# Altium project Liv_Flo_Sign.PrjPcb (part 2 of 2)
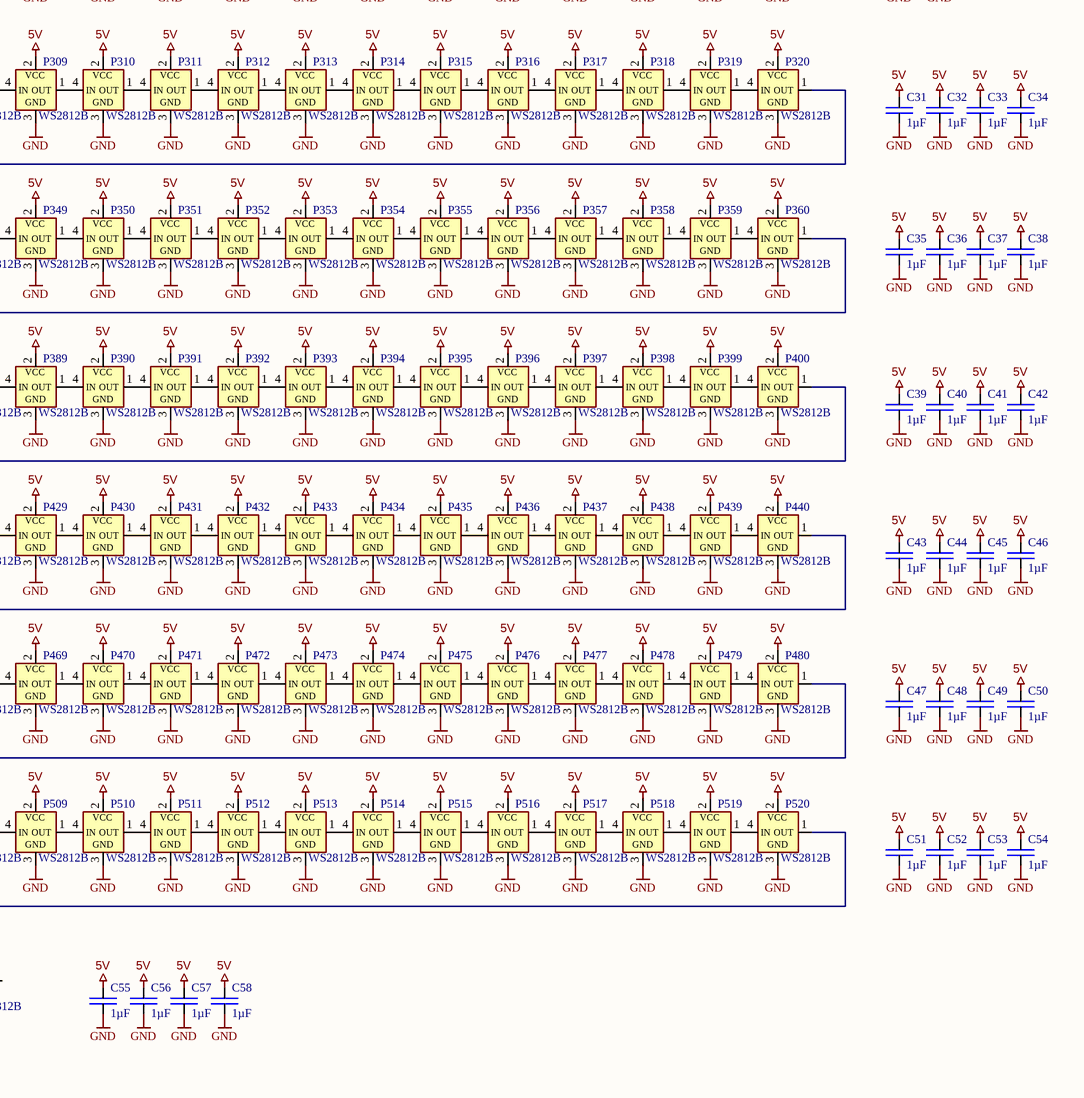
[diagram p5: Liv_Flo_Sign_LED_V1.0.SchDoc, bottom right]

## Sheet Liv_Flo_Sign_LED_V1.0.SchDoc: Liv-Flo Sign (continued)

### Nets
5V: C17.2 C18.2 C19.2 C20.2 C21.2 C22.2 C23.2 C24.2 C25.2 C26.2 C27.2 C28.2 C29.2 C30.2 C31.2 C32.2 C33.2 C34.2 C35.2 C36.2 C37.2 C38.2 C39.2 C40.2 C41.2 C42.2 C43.2 C44.2 C45.2 C46.2 C47.2 C48.2 C49.2 C50.2 C51.2 C52.2 C53.2 C54.2 C55.2 C56.2 C57.2 C58.2 P1.2(VCC) P2.2(VCC) P3.2(VCC) P4.2(VCC) P5.2(VCC) P6.2(VCC) P7.2(VCC) P8.2(VCC) P9.2(VCC) P10.2(VCC) P11.2(VCC) P12.2(VCC) P13.2(VCC) P14.2(VCC) P15.2(VCC) P16.2(VCC) P17.2(VCC) P18.2(VCC) P19.2(VCC) P20.2(VCC) P21.2(VCC) P22.2(VCC) P23.2(VCC) P24.2(VCC) P25.2(VCC) P26.2(VCC) P27.2(VCC) P28.2(VCC) P29.2(VCC) P30.2(VCC) P31.2(VCC) P32.2(VCC) P33.2(VCC) P34.2(VCC) P35.2(VCC) P36.2(VCC) P37.2(VCC) P38.2(VCC) P39.2(VCC) P40.2(VCC) P41.2(VCC) P42.2(VCC) P43.2(VCC) P44.2(VCC) P45.2(VCC) P46.2(VCC) P47.2(VCC) P48.2(VCC) P49.2(VCC) P50.2(VCC) P51.2(VCC) P52.2(VCC) P53.2(VCC) P54.2(VCC) P55.2(VCC) P56.2(VCC) P57.2(VCC) P58.2(VCC) P59.2(VCC) P60.2(VCC) P61.2(VCC) P62.2(VCC) P63.2(VCC) P64.2(VCC) P65.2(VCC) P66.2(VCC) P67.2(VCC) P68.2(VCC) P69.2(VCC) P70.2(VCC) P71.2(VCC) P72.2(VCC) P73.2(VCC) P74.2(VCC) P75.2(VCC) P76.2(VCC) P77.2(VCC) P78.2(VCC) P79.2(VCC) P80.2(VCC) P81.2(VCC) P82.2(VCC) P83.2(VCC) P84.2(VCC) P85.2(VCC) P86.2(VCC) P87.2(VCC) P88.2(VCC) P89.2(VCC) P90.2(VCC) P91.2(VCC) P92.2(VCC) P93.2(VCC) P94.2(VCC) P95.2(VCC) P96.2(VCC) P97.2(VCC) P98.2(VCC) P99.2(VCC) P100.2(VCC) P101.2(VCC) P102.2(VCC) P103.2(VCC) P104.2(VCC) P105.2(VCC) P106.2(VCC) P107.2(VCC) P108.2(VCC) P109.2(VCC) P110.2(VCC) P111.2(VCC) P112.2(VCC) P113.2(VCC) P114.2(VCC) P115.2(VCC) P116.2(VCC) P117.2(VCC) P118.2(VCC) P119.2(VCC) P120.2(VCC) P121.2(VCC) P122.2(VCC) P123.2(VCC) P124.2(VCC) P125.2(VCC) P126.2(VCC) P127.2(VCC) P128.2(VCC) P129.2(VCC) P130.2(VCC) P131.2(VCC) P132.2(VCC) P133.2(VCC) P134.2(VCC) P135.2(VCC) P136.2(VCC) P137.2(VCC) P138.2(VCC) P139.2(VCC) P140.2(VCC) P141.2(VCC) P142.2(VCC) P143.2(VCC) P144.2(VCC) P145.2(VCC) P146.2(VCC) P147.2(VCC) P148.2(VCC) P149.2(VCC) P150.2(VCC) P151.2(VCC) P152.2(VCC) P153.2(VCC) P154.2(VCC) P155.2(VCC) P156.2(VCC) P157.2(VCC) P158.2(VCC) P159.2(VCC) P160.2(VCC) P161.2(VCC) P162.2(VCC) P163.2(VCC) P164.2(VCC) P165.2(VCC) P166.2(VCC) P167.2(VCC) P168.2(VCC) P169.2(VCC) P170.2(VCC) P171.2(VCC) P172.2(VCC) P173.2(VCC) P174.2(VCC) P175.2(VCC) P176.2(VCC) P177.2(VCC) P178.2(VCC) P179.2(VCC) P180.2(VCC) P181.2(VCC) P182.2(VCC) P183.2(VCC) P184.2(VCC) P185.2(VCC) P186.2(VCC) P187.2(VCC) P188.2(VCC) P189.2(VCC) P190.2(VCC) P191.2(VCC) P192.2(VCC) P193.2(VCC) P194.2(VCC) P195.2(VCC) P196.2(VCC) P197.2(VCC) P198.2(VCC) P199.2(VCC) P200.2(VCC) P201.2(VCC) P202.2(VCC) P203.2(VCC) P204.2(VCC) P205.2(VCC) P206.2(VCC) P207.2(VCC) P208.2(VCC) P209.2(VCC) P210.2(VCC) P211.2(VCC) P212.2(VCC) P213.2(VCC) P214.2(VCC) P215.2(VCC) P216.2(VCC) P217.2(VCC) P218.2(VCC) P219.2(VCC) P220.2(VCC) P221.2(VCC) P222.2(VCC) P223.2(VCC) P224.2(VCC) P225.2(VCC) P226.2(VCC) P227.2(VCC) P228.2(VCC) P229.2(VCC) P230.2(VCC) P231.2(VCC) P232.2(VCC) P233.2(VCC) P234.2(VCC) P235.2(VCC) P236.2(VCC) P237.2(VCC) P238.2(VCC) P239.2(VCC) P240.2(VCC) P241.2(VCC) P242.2(VCC) P243.2(VCC) P244.2(VCC) P245.2(VCC) P246.2(VCC) P247.2(VCC) P248.2(VCC) P249.2(VCC) P250.2(VCC) P251.2(VCC) P252.2(VCC) P253.2(VCC) P254.2(VCC) P255.2(VCC) P256.2(VCC) P257.2(VCC) P258.2(VCC) P259.2(VCC) P260.2(VCC) P261.2(VCC) P262.2(VCC) P263.2(VCC) P264.2(VCC) P265.2(VCC) P266.2(VCC) P267.2(VCC) P268.2(VCC) P269.2(VCC) P270.2(VCC) P271.2(VCC) P272.2(VCC) P273.2(VCC) P274.2(VCC) P275.2(VCC) P276.2(VCC) P277.2(VCC) P278.2(VCC) P279.2(VCC) P280.2(VCC) P281.2(VCC) P282.2(VCC) P283.2(VCC) P284.2(VCC) P285.2(VCC) P286.2(VCC) P287.2(VCC) P288.2(VCC) P289.2(VCC) P290.2(VCC) P291.2(VCC) P292.2(VCC) P293.2(VCC) P294.2(VCC) P295.2(VCC) P296.2(VCC) P297.2(VCC) P298.2(VCC) P299.2(VCC) P300.2(VCC) P301.2(VCC) P302.2(VCC) P303.2(VCC) P304.2(VCC) P305.2(VCC) P306.2(VCC) P307.2(VCC) P308.2(VCC) P309.2(VCC) P310.2(VCC) P311.2(VCC) P312.2(VCC) P313.2(VCC) P314.2(VCC) P315.2(VCC) P316.2(VCC) P317.2(VCC) P318.2(VCC) P319.2(VCC) P320.2(VCC) P321.2(VCC) P322.2(VCC) P323.2(VCC) P324.2(VCC) P325.2(VCC) P326.2(VCC) P327.2(VCC) P328.2(VCC) P329.2(VCC) P330.2(VCC) P331.2(VCC) P332.2(VCC) P333.2(VCC) P334.2(VCC) P335.2(VCC) P336.2(VCC) P337.2(VCC) P338.2(VCC) P339.2(VCC) P340.2(VCC) P341.2(VCC) P342.2(VCC) P343.2(VCC) P344.2(VCC) P345.2(VCC) P346.2(VCC) P347.2(VCC) P348.2(VCC) P349.2(VCC) P350.2(VCC) P351.2(VCC) P352.2(VCC) P353.2(VCC) P354.2(VCC) P355.2(VCC) P356.2(VCC) P357.2(VCC) P358.2(VCC) P359.2(VCC) P360.2(VCC) P361.2(VCC) P362.2(VCC) P363.2(VCC) P364.2(VCC) P365.2(VCC) P366.2(VCC) P367.2(VCC) P368.2(VCC) P369.2(VCC) P370.2(VCC) P371.2(VCC) P372.2(VCC) P373.2(VCC) P374.2(VCC) P375.2(VCC) P376.2(VCC) P377.2(VCC) P378.2(VCC) P379.2(VCC) P380.2(VCC) P381.2(VCC) P382.2(VCC) P383.2(VCC) P384.2(VCC) P385.2(VCC) P386.2(VCC) P387.2(VCC) P388.2(VCC) P389.2(VCC) P390.2(VCC) P391.2(VCC) P392.2(VCC) P393.2(VCC) P394.2(VCC) P395.2(VCC) P396.2(VCC) P397.2(VCC) P398.2(VCC) P399.2(VCC) P400.2(VCC) P401.2(VCC) P402.2(VCC) P403.2(VCC) P404.2(VCC) P405.2(VCC) P406.2(VCC) P407.2(VCC) P408.2(VCC) P409.2(VCC) P410.2(VCC) P411.2(VCC) P412.2(VCC) P413.2(VCC) P414.2(VCC) P415.2(VCC) P416.2(VCC) P417.2(VCC) P418.2(VCC) P419.2(VCC) P420.2(VCC) P421.2(VCC) P422.2(VCC) P423.2(VCC) P424.2(VCC) P425.2(VCC) P426.2(VCC) P427.2(VCC) P428.2(VCC) P429.2(VCC) P430.2(VCC) P431.2(VCC) P432.2(VCC) P433.2(VCC) P434.2(VCC) P435.2(VCC) P436.2(VCC) P437.2(VCC) P438.2(VCC) P439.2(VCC) P440.2(VCC) P441.2(VCC) P442.2(VCC) P443.2(VCC) P444.2(VCC) P445.2(VCC) P446.2(VCC) P447.2(VCC) P448.2(VCC) P449.2(VCC) P450.2(VCC) P451.2(VCC) P452.2(VCC) P453.2(VCC) P454.2(VCC) P455.2(VCC) P456.2(VCC) P457.2(VCC) P458.2(VCC) P459.2(VCC) P460.2(VCC) P461.2(VCC) P462.2(VCC) P463.2(VCC) P464.2(VCC) P465.2(VCC) P466.2(VCC) P467.2(VCC) P468.2(VCC) P469.2(VCC) P470.2(VCC) P471.2(VCC) P472.2(VCC) P473.2(VCC) P474.2(VCC) P475.2(VCC) P476.2(VCC) P477.2(VCC) P478.2(VCC) P479.2(VCC) P480.2(VCC) P481.2(VCC) P482.2(VCC) P483.2(VCC) P484.2(VCC) P485.2(VCC) P486.2(VCC) P487.2(VCC) P488.2(VCC) P489.2(VCC) P490.2(VCC) P491.2(VCC) P492.2(VCC) P493.2(VCC) P494.2(VCC) P495.2(VCC) P496.2(VCC) P497.2(VCC) P498.2(VCC) P499.2(VCC) P500.2(VCC) P501.2(VCC) P502.2(VCC) P503.2(VCC) P504.2(VCC) P505.2(VCC) P506.2(VCC) P507.2(VCC) P508.2(VCC) P509.2(VCC) P510.2(VCC) P511.2(VCC) P512.2(VCC) P513.2(VCC) P514.2(VCC) P515.2(VCC) P516.2(VCC) P517.2(VCC) P518.2(VCC) P519.2(VCC) P520.2(VCC) P521.2(VCC) P522.2(VCC) P523.2(VCC) P524.2(VCC) P525.2(VCC) P526.2(VCC) P527.2(VCC) P528.2(VCC) P529.2(VCC) P530.2(VCC) P531.2(VCC) P532.2(VCC) P533.2(VCC) P534.2(VCC) P535.2(VCC) P536.2(VCC) P537.2(VCC) P538.2(VCC) P539.2(VCC) P540.2(VCC) P541.2(VCC) P542.2(VCC) P543.2(VCC) P544.2(VCC) P545.2(VCC) P546.2(VCC) P547.2(VCC) P548.2(VCC)
GND: C17.1 C18.1 C19.1 C20.1 C21.1 C22.1 C23.1 C24.1 C25.1 C26.1 C27.1 C28.1 C29.1 C30.1 C31.1 C32.1 C33.1 C34.1 C35.1 C36.1 C37.1 C38.1 C39.1 C40.1 C41.1 C42.1 C43.1 C44.1 C45.1 C46.1 C47.1 C48.1 C49.1 C50.1 C51.1 C52.1 C53.1 C54.1 C55.1 C56.1 C57.1 C58.1 P1.3(GND) P2.3(GND) P3.3(GND) P4.3(GND) P5.3(GND) P6.3(GND) P7.3(GND) P8.3(GND) P9.3(GND) P10.3(GND) P11.3(GND) P12.3(GND) P13.3(GND) P14.3(GND) P15.3(GND) P16.3(GND) P17.3(GND) P18.3(GND) P19.3(GND) P20.3(GND) P21.3(GND) P22.3(GND) P23.3(GND) P24.3(GND) P25.3(GND) P26.3(GND) P27.3(GND) P28.3(GND) P29.3(GND) P30.3(GND) P31.3(GND) P32.3(GND) P33.3(GND) P34.3(GND) P35.3(GND) P36.3(GND) P37.3(GND) P38.3(GND) P39.3(GND) P40.3(GND) P41.3(GND) P42.3(GND) P43.3(GND) P44.3(GND) P45.3(GND) P46.3(GND) P47.3(GND) P48.3(GND) P49.3(GND) P50.3(GND) P51.3(GND) P52.3(GND) P53.3(GND) P54.3(GND) P55.3(GND) P56.3(GND) P57.3(GND) P58.3(GND) P59.3(GND) P60.3(GND) P61.3(GND) P62.3(GND) P63.3(GND) P64.3(GND) P65.3(GND) P66.3(GND) P67.3(GND) P68.3(GND) P69.3(GND) P70.3(GND) P71.3(GND) P72.3(GND) P73.3(GND) P74.3(GND) P75.3(GND) P76.3(GND) P77.3(GND) P78.3(GND) P79.3(GND) P80.3(GND) P81.3(GND) P82.3(GND) P83.3(GND) P84.3(GND) P85.3(GND) P86.3(GND) P87.3(GND) P88.3(GND) P89.3(GND) P90.3(GND) P91.3(GND) P92.3(GND) P93.3(GND) P94.3(GND) P95.3(GND) P96.3(GND) P97.3(GND) P98.3(GND) P99.3(GND) P100.3(GND) P101.3(GND) P102.3(GND) P103.3(GND) P104.3(GND) P105.3(GND) P106.3(GND) P107.3(GND) P108.3(GND) P109.3(GND) P110.3(GND) P111.3(GND) P112.3(GND) P113.3(GND) P114.3(GND) P115.3(GND) P116.3(GND) P117.3(GND) P118.3(GND) P119.3(GND) P120.3(GND) P121.3(GND) P122.3(GND) P123.3(GND) P124.3(GND) P125.3(GND) P126.3(GND) P127.3(GND) P128.3(GND) P129.3(GND) P130.3(GND) P131.3(GND) P132.3(GND) P133.3(GND) P134.3(GND) P135.3(GND) P136.3(GND) P137.3(GND) P138.3(GND) P139.3(GND) P140.3(GND) P141.3(GND) P142.3(GND) P143.3(GND) P144.3(GND) P145.3(GND) P146.3(GND) P147.3(GND) P148.3(GND) P149.3(GND) P150.3(GND) P151.3(GND) P152.3(GND) P153.3(GND) P154.3(GND) P155.3(GND) P156.3(GND) P157.3(GND) P158.3(GND) P159.3(GND) P160.3(GND) P161.3(GND) P162.3(GND) P163.3(GND) P164.3(GND) P165.3(GND) P166.3(GND) P167.3(GND) P168.3(GND) P169.3(GND) P170.3(GND) P171.3(GND) P172.3(GND) P173.3(GND) P174.3(GND) P175.3(GND) P176.3(GND) P177.3(GND) P178.3(GND) P179.3(GND) P180.3(GND) P181.3(GND) P182.3(GND) P183.3(GND) P184.3(GND) P185.3(GND) P186.3(GND) P187.3(GND) P188.3(GND) P189.3(GND) P190.3(GND) P191.3(GND) P192.3(GND) P193.3(GND) P194.3(GND) P195.3(GND) P196.3(GND) P197.3(GND) P198.3(GND) P199.3(GND) P200.3(GND) P201.3(GND) P202.3(GND) P203.3(GND) P204.3(GND) P205.3(GND) P206.3(GND) P207.3(GND) P208.3(GND) P209.3(GND) P210.3(GND) P211.3(GND) P212.3(GND) P213.3(GND) P214.3(GND) P215.3(GND) P216.3(GND) P217.3(GND) P218.3(GND) P219.3(GND) P220.3(GND) P221.3(GND) P222.3(GND) P223.3(GND) P224.3(GND) P225.3(GND) P226.3(GND) P227.3(GND) P228.3(GND) P229.3(GND) P230.3(GND) P231.3(GND) P232.3(GND) P233.3(GND) P234.3(GND) P235.3(GND) P236.3(GND) P237.3(GND) P238.3(GND) P239.3(GND) P240.3(GND) P241.3(GND) P242.3(GND) P243.3(GND) P244.3(GND) P245.3(GND) P246.3(GND) P247.3(GND) P248.3(GND) P249.3(GND) P250.3(GND) P251.3(GND) P252.3(GND) P253.3(GND) P254.3(GND) P255.3(GND) P256.3(GND) P257.3(GND) P258.3(GND) P259.3(GND) P260.3(GND) P261.3(GND) P262.3(GND) P263.3(GND) P264.3(GND) P265.3(GND) P266.3(GND) P267.3(GND) P268.3(GND) P269.3(GND) P270.3(GND) P271.3(GND) P272.3(GND) P273.3(GND) P274.3(GND) P275.3(GND) P276.3(GND) P277.3(GND) P278.3(GND) P279.3(GND) P280.3(GND) P281.3(GND) P282.3(GND) P283.3(GND) P284.3(GND) P285.3(GND) P286.3(GND) P287.3(GND) P288.3(GND) P289.3(GND) P290.3(GND) P291.3(GND) P292.3(GND) P293.3(GND) P294.3(GND) P295.3(GND) P296.3(GND) P297.3(GND) P298.3(GND) P299.3(GND) P300.3(GND) P301.3(GND) P302.3(GND) P303.3(GND) P304.3(GND) P305.3(GND) P306.3(GND) P307.3(GND) P308.3(GND) P309.3(GND) P310.3(GND) P311.3(GND) P312.3(GND) P313.3(GND) P314.3(GND) P315.3(GND) P316.3(GND) P317.3(GND) P318.3(GND) P319.3(GND) P320.3(GND) P321.3(GND) P322.3(GND) P323.3(GND) P324.3(GND) P325.3(GND) P326.3(GND) P327.3(GND) P328.3(GND) P329.3(GND) P330.3(GND) P331.3(GND) P332.3(GND) P333.3(GND) P334.3(GND) P335.3(GND) P336.3(GND) P337.3(GND) P338.3(GND) P339.3(GND) P340.3(GND) P341.3(GND) P342.3(GND) P343.3(GND) P344.3(GND) P345.3(GND) P346.3(GND) P347.3(GND) P348.3(GND) P349.3(GND) P350.3(GND) P351.3(GND) P352.3(GND) P353.3(GND) P354.3(GND) P355.3(GND) P356.3(GND) P357.3(GND) P358.3(GND) P359.3(GND) P360.3(GND) P361.3(GND) P362.3(GND) P363.3(GND) P364.3(GND) P365.3(GND) P366.3(GND) P367.3(GND) P368.3(GND) P369.3(GND) P370.3(GND) P371.3(GND) P372.3(GND) P373.3(GND) P374.3(GND) P375.3(GND) P376.3(GND) P377.3(GND) P378.3(GND) P379.3(GND) P380.3(GND) P381.3(GND) P382.3(GND) P383.3(GND) P384.3(GND) P385.3(GND) P386.3(GND) P387.3(GND) P388.3(GND) P389.3(GND) P390.3(GND) P391.3(GND) P392.3(GND) P393.3(GND) P394.3(GND) P395.3(GND) P396.3(GND) P397.3(GND) P398.3(GND) P399.3(GND) P400.3(GND) P401.3(GND) P402.3(GND) P403.3(GND) P404.3(GND) P405.3(GND) P406.3(GND) P407.3(GND) P408.3(GND) P409.3(GND) P410.3(GND) P411.3(GND) P412.3(GND) P413.3(GND) P414.3(GND) P415.3(GND) P416.3(GND) P417.3(GND) P418.3(GND) P419.3(GND) P420.3(GND) P421.3(GND) P422.3(GND) P423.3(GND) P424.3(GND) P425.3(GND) P426.3(GND) P427.3(GND) P428.3(GND) P429.3(GND) P430.3(GND) P431.3(GND) P432.3(GND) P433.3(GND) P434.3(GND) P435.3(GND) P436.3(GND) P437.3(GND) P438.3(GND) P439.3(GND) P440.3(GND) P441.3(GND) P442.3(GND) P443.3(GND) P444.3(GND) P445.3(GND) P446.3(GND) P447.3(GND) P448.3(GND) P449.3(GND) P450.3(GND) P451.3(GND) P452.3(GND) P453.3(GND) P454.3(GND) P455.3(GND) P456.3(GND) P457.3(GND) P458.3(GND) P459.3(GND) P460.3(GND) P461.3(GND) P462.3(GND) P463.3(GND) P464.3(GND) P465.3(GND) P466.3(GND) P467.3(GND) P468.3(GND) P469.3(GND) P470.3(GND) P471.3(GND) P472.3(GND) P473.3(GND) P474.3(GND) P475.3(GND) P476.3(GND) P477.3(GND) P478.3(GND) P479.3(GND) P480.3(GND) P481.3(GND) P482.3(GND) P483.3(GND) P484.3(GND) P485.3(GND) P486.3(GND) P487.3(GND) P488.3(GND) P489.3(GND) P490.3(GND) P491.3(GND) P492.3(GND) P493.3(GND) P494.3(GND) P495.3(GND) P496.3(GND) P497.3(GND) P498.3(GND) P499.3(GND) P500.3(GND) P501.3(GND) P502.3(GND) P503.3(GND) P504.3(GND) P505.3(GND) P506.3(GND) P507.3(GND) P508.3(GND) P509.3(GND) P510.3(GND) P511.3(GND) P512.3(GND) P513.3(GND) P514.3(GND) P515.3(GND) P516.3(GND) P517.3(GND) P518.3(GND) P519.3(GND) P520.3(GND) P521.3(GND) P522.3(GND) P523.3(GND) P524.3(GND) P525.3(GND) P526.3(GND) P527.3(GND) P528.3(GND) P529.3(GND) P530.3(GND) P531.3(GND) P532.3(GND) P533.3(GND) P534.3(GND) P535.3(GND) P536.3(GND) P537.3(GND) P538.3(GND) P539.3(GND) P540.3(GND) P541.3(GND) P542.3(GND) P543.3(GND) P544.3(GND) P545.3(GND) P546.3(GND) P547.3(GND) P548.3(GND)
LED_MAT: P1.4(IN) ; port LED_MAT
LED_SIGN: P281.4(IN) ; port LED_SIGN
NetP1_1: P1.1(OUT) P2.4(IN)
NetP2_1: P2.1(OUT) P3.4(IN)
NetP3_1: P3.1(OUT) P4.4(IN)
NetP4_1: P4.1(OUT) P5.4(IN)
NetP5_1: P5.1(OUT) P6.4(IN)
NetP6_1: P6.1(OUT) P7.4(IN)
NetP7_1: P7.1(OUT) P8.4(IN)
NetP8_1: P8.1(OUT) P9.4(IN)
NetP9_1: P9.1(OUT) P10.4(IN)
NetP10_1: P10.1(OUT) P11.4(IN)
NetP11_1: P11.1(OUT) P12.4(IN)
NetP12_1: P12.1(OUT) P13.4(IN)
NetP13_1: P13.1(OUT) P14.4(IN)
NetP14_1: P14.1(OUT) P15.4(IN)
NetP15_1: P15.1(OUT) P16.4(IN)
NetP16_1: P16.1(OUT) P17.4(IN)
NetP17_1: P17.1(OUT) P18.4(IN)
NetP18_1: P18.1(OUT) P19.4(IN)
NetP19_1: P19.1(OUT) P20.4(IN)
NetP20_1: P20.1(OUT) P21.4(IN)
NetP21_1: P21.1(OUT) P22.4(IN)
NetP22_1: P22.1(OUT) P23.4(IN)
NetP23_1: P23.1(OUT) P24.4(IN)
NetP24_1: P24.1(OUT) P25.4(IN)
NetP25_1: P25.1(OUT) P26.4(IN)
NetP26_1: P26.1(OUT) P27.4(IN)
NetP27_1: P27.1(OUT) P28.4(IN)
NetP28_1: P28.1(OUT) P29.4(IN)
NetP29_1: P29.1(OUT) P30.4(IN)
NetP30_1: P30.1(OUT) P31.4(IN)
NetP31_1: P31.1(OUT) P32.4(IN)
NetP32_1: P32.1(OUT) P33.4(IN)
NetP33_1: P33.1(OUT) P34.4(IN)
NetP34_1: P34.1(OUT) P35.4(IN)
NetP35_1: P35.1(OUT) P36.4(IN)
NetP36_1: P36.1(OUT) P37.4(IN)
NetP37_1: P37.1(OUT) P38.4(IN)
NetP38_1: P38.1(OUT) P39.4(IN)
NetP39_1: P39.1(OUT) P40.4(IN)
NetP40_1: P40.1(OUT) P41.4(IN)
NetP41_1: P41.1(OUT) P42.4(IN)
NetP42_1: P42.1(OUT) P43.4(IN)
NetP43_1: P43.1(OUT) P44.4(IN)
NetP44_1: P44.1(OUT) P45.4(IN)
NetP45_1: P45.1(OUT) P46.4(IN)
NetP46_1: P46.1(OUT) P47.4(IN)
NetP47_1: P47.1(OUT) P48.4(IN)
NetP48_1: P48.1(OUT) P49.4(IN)
NetP49_1: P49.1(OUT) P50.4(IN)
NetP50_1: P50.1(OUT) P51.4(IN)
NetP51_1: P51.1(OUT) P52.4(IN)
NetP52_1: P52.1(OUT) P53.4(IN)
NetP53_1: P53.1(OUT) P54.4(IN)
NetP54_1: P54.1(OUT) P55.4(IN)
NetP55_1: P55.1(OUT) P56.4(IN)
NetP56_1: P56.1(OUT) P57.4(IN)
NetP57_1: P57.1(OUT) P58.4(IN)
NetP58_1: P58.1(OUT) P59.4(IN)
NetP59_1: P59.1(OUT) P60.4(IN)
NetP60_1: P60.1(OUT) P61.4(IN)
NetP61_1: P61.1(OUT) P62.4(IN)
NetP62_1: P62.1(OUT) P63.4(IN)
NetP63_1: P63.1(OUT) P64.4(IN)
NetP64_1: P64.1(OUT) P65.4(IN)
NetP65_1: P65.1(OUT) P66.4(IN)
NetP66_1: P66.1(OUT) P67.4(IN)
NetP67_1: P67.1(OUT) P68.4(IN)
NetP68_1: P68.1(OUT) P69.4(IN)
NetP69_1: P69.1(OUT) P70.4(IN)
NetP70_1: P70.1(OUT) P71.4(IN)
NetP71_1: P71.1(OUT) P72.4(IN)
NetP72_1: P72.1(OUT) P73.4(IN)
NetP73_1: P73.1(OUT) P74.4(IN)
NetP74_1: P74.1(OUT) P75.4(IN)
NetP75_1: P75.1(OUT) P76.4(IN)
NetP76_1: P76.1(OUT) P77.4(IN)
NetP77_1: P77.1(OUT) P78.4(IN)
NetP78_1: P78.1(OUT) P79.4(IN)
NetP79_1: P79.1(OUT) P80.4(IN)
NetP80_1: P80.1(OUT) P81.4(IN)
NetP81_1: P81.1(OUT) P82.4(IN)
NetP82_1: P82.1(OUT) P83.4(IN)
NetP83_1: P83.1(OUT) P84.4(IN)
NetP84_1: P84.1(OUT) P85.4(IN)
NetP85_1: P85.1(OUT) P86.4(IN)
NetP86_1: P86.1(OUT) P87.4(IN)
NetP87_1: P87.1(OUT) P88.4(IN)
NetP88_1: P88.1(OUT) P89.4(IN)
NetP89_1: P89.1(OUT) P90.4(IN)
NetP90_1: P90.1(OUT) P91.4(IN)
NetP91_1: P91.1(OUT) P92.4(IN)
NetP92_1: P92.1(OUT) P93.4(IN)
NetP93_1: P93.1(OUT) P94.4(IN)
NetP94_1: P94.1(OUT) P95.4(IN)
NetP95_1: P95.1(OUT) P96.4(IN)
NetP96_1: P96.1(OUT) P97.4(IN)
NetP97_1: P97.1(OUT) P98.4(IN)
NetP98_1: P98.1(OUT) P99.4(IN)
NetP99_1: P99.1(OUT) P100.4(IN)
NetP100_1: P100.1(OUT) P101.4(IN)
NetP101_1: P101.1(OUT) P102.4(IN)
NetP102_1: P102.1(OUT) P103.4(IN)
NetP103_1: P103.1(OUT) P104.4(IN)
NetP104_1: P104.1(OUT) P105.4(IN)
NetP105_1: P105.1(OUT) P106.4(IN)
NetP106_1: P106.1(OUT) P107.4(IN)
NetP107_1: P107.1(OUT) P108.4(IN)
NetP108_1: P108.1(OUT) P109.4(IN)
NetP109_1: P109.1(OUT) P110.4(IN)
NetP110_1: P110.1(OUT) P111.4(IN)
NetP111_1: P111.1(OUT) P112.4(IN)
NetP112_1: P112.1(OUT) P113.4(IN)
NetP113_1: P113.1(OUT) P114.4(IN)
NetP114_1: P114.1(OUT) P115.4(IN)
NetP115_1: P115.1(OUT) P116.4(IN)
NetP116_1: P116.1(OUT) P117.4(IN)
NetP117_1: P117.1(OUT) P118.4(IN)
NetP118_1: P118.1(OUT) P119.4(IN)
NetP119_1: P119.1(OUT) P120.4(IN)
NetP120_1: P120.1(OUT) P121.4(IN)
NetP121_1: P121.1(OUT) P122.4(IN)
NetP122_1: P122.1(OUT) P123.4(IN)
NetP123_1: P123.1(OUT) P124.4(IN)
NetP124_1: P124.1(OUT) P125.4(IN)
NetP125_1: P125.1(OUT) P126.4(IN)
NetP126_1: P126.1(OUT) P127.4(IN)
NetP127_1: P127.1(OUT) P128.4(IN)
NetP128_1: P128.1(OUT) P129.4(IN)
NetP129_1: P129.1(OUT) P130.4(IN)
NetP130_1: P130.1(OUT) P131.4(IN)
NetP131_1: P131.1(OUT) P132.4(IN)
NetP132_1: P132.1(OUT) P133.4(IN)
NetP133_1: P133.1(OUT) P134.4(IN)
NetP134_1: P134.1(OUT) P135.4(IN)
NetP135_1: P135.1(OUT) P136.4(IN)
NetP136_1: P136.1(OUT) P137.4(IN)
NetP137_1: P137.1(OUT) P138.4(IN)
NetP138_1: P138.1(OUT) P139.4(IN)
NetP139_1: P139.1(OUT) P140.4(IN)
NetP140_1: P140.1(OUT) P141.4(IN)
NetP141_1: P141.1(OUT) P142.4(IN)
NetP142_1: P142.1(OUT) P143.4(IN)
NetP143_1: P143.1(OUT) P144.4(IN)
NetP144_1: P144.1(OUT) P145.4(IN)
NetP145_1: P145.1(OUT) P146.4(IN)
NetP146_1: P146.1(OUT) P147.4(IN)
NetP147_1: P147.1(OUT) P148.4(IN)
NetP148_1: P148.1(OUT) P149.4(IN)
NetP149_1: P149.1(OUT) P150.4(IN)
NetP150_1: P150.1(OUT) P151.4(IN)
NetP151_1: P151.1(OUT) P152.4(IN)
NetP152_1: P152.1(OUT) P153.4(IN)
NetP153_1: P153.1(OUT) P154.4(IN)
NetP154_1: P154.1(OUT) P155.4(IN)
NetP155_1: P155.1(OUT) P156.4(IN)
NetP156_1: P156.1(OUT) P157.4(IN)
NetP157_1: P157.1(OUT) P158.4(IN)
NetP158_1: P158.1(OUT) P159.4(IN)
NetP159_1: P159.1(OUT) P160.4(IN)
NetP160_1: P160.1(OUT) P161.4(IN)
NetP161_1: P161.1(OUT) P162.4(IN)
NetP162_1: P162.1(OUT) P163.4(IN)
NetP163_1: P163.1(OUT) P164.4(IN)
NetP164_1: P164.1(OUT) P165.4(IN)
NetP165_1: P165.1(OUT) P166.4(IN)
NetP166_1: P166.1(OUT) P167.4(IN)
NetP167_1: P167.1(OUT) P168.4(IN)
NetP168_1: P168.1(OUT) P169.4(IN)
NetP169_1: P169.1(OUT) P170.4(IN)
NetP170_1: P170.1(OUT) P171.4(IN)
NetP171_1: P171.1(OUT) P172.4(IN)
NetP172_1: P172.1(OUT) P173.4(IN)
NetP173_1: P173.1(OUT) P174.4(IN)
NetP174_1: P174.1(OUT) P175.4(IN)
NetP175_1: P175.1(OUT) P176.4(IN)
NetP176_1: P176.1(OUT) P177.4(IN)
NetP177_1: P177.1(OUT) P178.4(IN)
NetP178_1: P178.1(OUT) P179.4(IN)
NetP179_1: P179.1(OUT) P180.4(IN)
NetP180_1: P180.1(OUT) P181.4(IN)
NetP181_1: P181.1(OUT) P182.4(IN)
NetP182_1: P182.1(OUT) P183.4(IN)
NetP183_1: P183.1(OUT) P184.4(IN)
NetP184_1: P184.1(OUT) P185.4(IN)
NetP185_1: P185.1(OUT) P186.4(IN)
NetP186_1: P186.1(OUT) P187.4(IN)
NetP187_1: P187.1(OUT) P188.4(IN)
NetP188_1: P188.1(OUT) P189.4(IN)
NetP189_1: P189.1(OUT) P190.4(IN)
NetP190_1: P190.1(OUT) P191.4(IN)
NetP191_1: P191.1(OUT) P192.4(IN)
NetP192_1: P192.1(OUT) P193.4(IN)
NetP193_1: P193.1(OUT) P194.4(IN)
NetP194_1: P194.1(OUT) P195.4(IN)
NetP195_1: P195.1(OUT) P196.4(IN)
NetP196_1: P196.1(OUT) P197.4(IN)
NetP197_1: P197.1(OUT) P198.4(IN)
NetP198_1: P198.1(OUT) P199.4(IN)
NetP199_1: P199.1(OUT) P200.4(IN)
NetP200_1: P200.1(OUT) P201.4(IN)
NetP201_1: P201.1(OUT) P202.4(IN)
NetP202_1: P202.1(OUT) P203.4(IN)
NetP203_1: P203.1(OUT) P204.4(IN)
NetP204_1: P204.1(OUT) P205.4(IN)
NetP205_1: P205.1(OUT) P206.4(IN)
NetP206_1: P206.1(OUT) P207.4(IN)
NetP207_1: P207.1(OUT) P208.4(IN)
NetP208_1: P208.1(OUT) P209.4(IN)
NetP209_1: P209.1(OUT) P210.4(IN)
NetP210_1: P210.1(OUT) P211.4(IN)
NetP211_1: P211.1(OUT) P212.4(IN)
NetP212_1: P212.1(OUT) P213.4(IN)
NetP213_1: P213.1(OUT) P214.4(IN)
NetP214_1: P214.1(OUT) P215.4(IN)
NetP215_1: P215.1(OUT) P216.4(IN)
NetP216_1: P216.1(OUT) P217.4(IN)
NetP217_1: P217.1(OUT) P218.4(IN)
NetP218_1: P218.1(OUT) P219.4(IN)
NetP219_1: P219.1(OUT) P220.4(IN)
NetP220_1: P220.1(OUT) P221.4(IN)
NetP221_1: P221.1(OUT) P222.4(IN)
NetP222_1: P222.1(OUT) P223.4(IN)
NetP223_1: P223.1(OUT) P224.4(IN)
NetP224_1: P224.1(OUT) P225.4(IN)
NetP225_1: P225.1(OUT) P226.4(IN)
NetP226_1: P226.1(OUT) P227.4(IN)
NetP227_1: P227.1(OUT) P228.4(IN)
NetP228_1: P228.1(OUT) P229.4(IN)
NetP229_1: P229.1(OUT) P230.4(IN)
NetP230_1: P230.1(OUT) P231.4(IN)
NetP231_1: P231.1(OUT) P232.4(IN)
NetP232_1: P232.1(OUT) P233.4(IN)
NetP233_1: P233.1(OUT) P234.4(IN)
NetP234_1: P234.1(OUT) P235.4(IN)
NetP235_1: P235.1(OUT) P236.4(IN)
NetP236_1: P236.1(OUT) P237.4(IN)
NetP237_1: P237.1(OUT) P238.4(IN)
NetP238_1: P238.1(OUT) P239.4(IN)
NetP239_1: P239.1(OUT) P240.4(IN)
NetP240_1: P240.1(OUT) P241.4(IN)
NetP241_1: P241.1(OUT) P242.4(IN)
NetP242_1: P242.1(OUT) P243.4(IN)
NetP243_1: P243.1(OUT) P244.4(IN)
NetP244_1: P244.1(OUT) P245.4(IN)
NetP245_1: P245.1(OUT) P246.4(IN)
NetP246_1: P246.1(OUT) P247.4(IN)
NetP247_1: P247.1(OUT) P248.4(IN)
NetP248_1: P248.1(OUT) P249.4(IN)
NetP249_1: P249.1(OUT) P250.4(IN)
NetP250_1: P250.1(OUT) P251.4(IN)
NetP251_1: P251.1(OUT) P252.4(IN)
NetP252_1: P252.1(OUT) P253.4(IN)
NetP253_1: P253.1(OUT) P254.4(IN)
NetP254_1: P254.1(OUT) P255.4(IN)
NetP255_1: P255.1(OUT) P256.4(IN)
NetP256_1: P256.1(OUT) P257.4(IN)
NetP257_1: P257.1(OUT) P258.4(IN)
NetP258_1: P258.1(OUT) P259.4(IN)
NetP259_1: P259.1(OUT) P260.4(IN)
NetP260_1: P260.1(OUT) P261.4(IN)
NetP261_1: P261.1(OUT) P262.4(IN)
NetP262_1: P262.1(OUT) P263.4(IN)
NetP263_1: P263.1(OUT) P264.4(IN)
NetP264_1: P264.1(OUT) P265.4(IN)
NetP265_1: P265.1(OUT) P266.4(IN)
NetP266_1: P266.1(OUT) P267.4(IN)
NetP267_1: P267.1(OUT) P268.4(IN)
NetP268_1: P268.1(OUT) P269.4(IN)
NetP269_1: P269.1(OUT) P270.4(IN)
NetP270_1: P270.1(OUT) P271.4(IN)
NetP271_1: P271.1(OUT) P272.4(IN)
NetP272_1: P272.1(OUT) P273.4(IN)
NetP273_1: P273.1(OUT) P274.4(IN)
NetP274_1: P274.1(OUT) P275.4(IN)
NetP275_1: P275.1(OUT) P276.4(IN)
NetP276_1: P276.1(OUT) P277.4(IN)
NetP277_1: P277.1(OUT) P278.4(IN)
NetP278_1: P278.1(OUT) P279.4(IN)
NetP279_1: P279.1(OUT) P280.4(IN)
NetP281_1: P281.1(OUT) P282.4(IN)
NetP282_1: P282.1(OUT) P283.4(IN)
NetP283_1: P283.1(OUT) P284.4(IN)
NetP284_1: P284.1(OUT) P285.4(IN)
NetP285_1: P285.1(OUT) P286.4(IN)
NetP286_1: P286.1(OUT) P287.4(IN)
NetP287_1: P287.1(OUT) P288.4(IN)
NetP288_1: P288.1(OUT) P289.4(IN)
NetP289_1: P289.1(OUT) P290.4(IN)
NetP290_1: P290.1(OUT) P291.4(IN)
NetP291_1: P291.1(OUT) P292.4(IN)
NetP292_1: P292.1(OUT) P293.4(IN)
NetP293_1: P293.1(OUT) P294.4(IN)
NetP294_1: P294.1(OUT) P295.4(IN)
NetP295_1: P295.1(OUT) P296.4(IN)
NetP296_1: P296.1(OUT) P297.4(IN)
NetP297_1: P297.1(OUT) P298.4(IN)
NetP298_1: P298.1(OUT) P299.4(IN)
NetP299_1: P299.1(OUT) P300.4(IN)
NetP300_1: P300.1(OUT) P301.4(IN)
NetP301_1: P301.1(OUT) P302.4(IN)
NetP302_1: P302.1(OUT) P303.4(IN)
NetP303_1: P303.1(OUT) P304.4(IN)
NetP304_1: P304.1(OUT) P305.4(IN)
NetP305_1: P305.1(OUT) P306.4(IN)
NetP306_1: P306.1(OUT) P307.4(IN)
NetP307_1: P307.1(OUT) P308.4(IN)
NetP308_1: P308.1(OUT) P309.4(IN)
NetP309_1: P309.1(OUT) P310.4(IN)
NetP310_1: P310.1(OUT) P311.4(IN)
NetP311_1: P311.1(OUT) P312.4(IN)
NetP312_1: P312.1(OUT) P313.4(IN)
NetP313_1: P313.1(OUT) P314.4(IN)
NetP314_1: P314.1(OUT) P315.4(IN)
NetP315_1: P315.1(OUT) P316.4(IN)
NetP316_1: P316.1(OUT) P317.4(IN)
NetP317_1: P317.1(OUT) P318.4(IN)
NetP318_1: P318.1(OUT) P319.4(IN)
NetP319_1: P319.1(OUT) P320.4(IN)
NetP320_1: P320.1(OUT) P321.4(IN)
NetP321_1: P321.1(OUT) P322.4(IN)
NetP322_1: P322.1(OUT) P323.4(IN)
NetP323_1: P323.1(OUT) P324.4(IN)
NetP324_1: P324.1(OUT) P325.4(IN)
NetP325_1: P325.1(OUT) P326.4(IN)
NetP326_1: P326.1(OUT) P327.4(IN)
NetP327_1: P327.1(OUT) P328.4(IN)
NetP328_1: P328.1(OUT) P329.4(IN)
NetP329_1: P329.1(OUT) P330.4(IN)
NetP330_1: P330.1(OUT) P331.4(IN)
NetP331_1: P331.1(OUT) P332.4(IN)
NetP332_1: P332.1(OUT) P333.4(IN)
NetP333_1: P333.1(OUT) P334.4(IN)
NetP334_1: P334.1(OUT) P335.4(IN)
NetP335_1: P335.1(OUT) P336.4(IN)
NetP336_1: P336.1(OUT) P337.4(IN)
NetP337_1: P337.1(OUT) P338.4(IN)
NetP338_1: P338.1(OUT) P339.4(IN)
NetP339_1: P339.1(OUT) P340.4(IN)
NetP340_1: P340.1(OUT) P341.4(IN)
NetP341_1: P341.1(OUT) P342.4(IN)
NetP342_1: P342.1(OUT) P343.4(IN)
NetP343_1: P343.1(OUT) P344.4(IN)
NetP344_1: P344.1(OUT) P345.4(IN)
NetP345_1: P345.1(OUT) P346.4(IN)
NetP346_1: P346.1(OUT) P347.4(IN)
NetP347_1: P347.1(OUT) P348.4(IN)
NetP348_1: P348.1(OUT) P349.4(IN)
NetP349_1: P349.1(OUT) P350.4(IN)
NetP350_1: P350.1(OUT) P351.4(IN)
NetP351_1: P351.1(OUT) P352.4(IN)
NetP352_1: P352.1(OUT) P353.4(IN)
NetP353_1: P353.1(OUT) P354.4(IN)
NetP354_1: P354.1(OUT) P355.4(IN)
NetP355_1: P355.1(OUT) P356.4(IN)
NetP356_1: P356.1(OUT) P357.4(IN)
NetP357_1: P357.1(OUT) P358.4(IN)
NetP358_1: P358.1(OUT) P359.4(IN)
NetP359_1: P359.1(OUT) P360.4(IN)
NetP360_1: P360.1(OUT) P361.4(IN)
NetP361_1: P361.1(OUT) P362.4(IN)
NetP362_1: P362.1(OUT) P363.4(IN)
NetP363_1: P363.1(OUT) P364.4(IN)
NetP364_1: P364.1(OUT) P365.4(IN)
NetP365_1: P365.1(OUT) P366.4(IN)
NetP366_1: P366.1(OUT) P367.4(IN)
NetP367_1: P367.1(OUT) P368.4(IN)
NetP368_1: P368.1(OUT) P369.4(IN)
NetP369_1: P369.1(OUT) P370.4(IN)
NetP370_1: P370.1(OUT) P371.4(IN)
NetP371_1: P371.1(OUT) P372.4(IN)
NetP372_1: P372.1(OUT) P373.4(IN)
NetP373_1: P373.1(OUT) P374.4(IN)
NetP374_1: P374.1(OUT) P375.4(IN)
NetP375_1: P375.1(OUT) P376.4(IN)
NetP376_1: P376.1(OUT) P377.4(IN)
NetP377_1: P377.1(OUT) P378.4(IN)
NetP378_1: P378.1(OUT) P379.4(IN)
NetP379_1: P379.1(OUT) P380.4(IN)
NetP380_1: P380.1(OUT) P381.4(IN)
NetP381_1: P381.1(OUT) P382.4(IN)
NetP382_1: P382.1(OUT) P383.4(IN)
NetP383_1: P383.1(OUT) P384.4(IN)
NetP384_1: P384.1(OUT) P385.4(IN)
NetP385_1: P385.1(OUT) P386.4(IN)
NetP386_1: P386.1(OUT) P387.4(IN)
NetP387_1: P387.1(OUT) P388.4(IN)
NetP388_1: P388.1(OUT) P389.4(IN)
NetP389_1: P389.1(OUT) P390.4(IN)
NetP390_1: P390.1(OUT) P391.4(IN)
NetP391_1: P391.1(OUT) P392.4(IN)
NetP392_1: P392.1(OUT) P393.4(IN)
NetP393_1: P393.1(OUT) P394.4(IN)
NetP394_1: P394.1(OUT) P395.4(IN)
NetP395_1: P395.1(OUT) P396.4(IN)
NetP396_1: P396.1(OUT) P397.4(IN)
NetP397_1: P397.1(OUT) P398.4(IN)
NetP398_1: P398.1(OUT) P399.4(IN)
NetP399_1: P399.1(OUT) P400.4(IN)
NetP400_1: P400.1(OUT) P401.4(IN)
NetP401_1: P401.1(OUT) P402.4(IN)
NetP402_1: P402.1(OUT) P403.4(IN)
NetP403_1: P403.1(OUT) P404.4(IN)
NetP404_1: P404.1(OUT) P405.4(IN)
NetP405_1: P405.1(OUT) P406.4(IN)
NetP406_1: P406.1(OUT) P407.4(IN)
NetP407_1: P407.1(OUT) P408.4(IN)
NetP408_1: P408.1(OUT) P409.4(IN)
NetP409_1: P409.1(OUT) P410.4(IN)
NetP410_1: P410.1(OUT) P411.4(IN)
NetP411_1: P411.1(OUT) P412.4(IN)
NetP412_1: P412.1(OUT) P413.4(IN)
NetP413_1: P413.1(OUT) P414.4(IN)
NetP414_1: P414.1(OUT) P415.4(IN)
NetP415_1: P415.1(OUT) P416.4(IN)
NetP416_1: P416.1(OUT) P417.4(IN)
NetP417_1: P417.1(OUT) P418.4(IN)
NetP418_1: P418.1(OUT) P419.4(IN)
NetP419_1: P419.1(OUT) P420.4(IN)
NetP420_1: P420.1(OUT) P421.4(IN)
NetP421_1: P421.1(OUT) P422.4(IN)
NetP422_1: P422.1(OUT) P423.4(IN)
NetP423_1: P423.1(OUT) P424.4(IN)
NetP424_1: P424.1(OUT) P425.4(IN)
NetP425_1: P425.1(OUT) P426.4(IN)
NetP426_1: P426.1(OUT) P427.4(IN)
NetP427_1: P427.1(OUT) P428.4(IN)
NetP428_1: P428.1(OUT) P429.4(IN)
NetP429_1: P429.1(OUT) P430.4(IN)
NetP430_1: P430.1(OUT) P431.4(IN)
NetP431_1: P431.1(OUT) P432.4(IN)
NetP432_1: P432.1(OUT) P433.4(IN)
NetP433_1: P433.1(OUT) P434.4(IN)
NetP434_1: P434.1(OUT) P435.4(IN)
NetP435_1: P435.1(OUT) P436.4(IN)
NetP436_1: P436.1(OUT) P437.4(IN)
NetP437_1: P437.1(OUT) P438.4(IN)
NetP438_1: P438.1(OUT) P439.4(IN)
NetP439_1: P439.1(OUT) P440.4(IN)
NetP440_1: P440.1(OUT) P441.4(IN)
NetP441_1: P441.1(OUT) P442.4(IN)
NetP442_1: P442.1(OUT) P443.4(IN)
NetP443_1: P443.1(OUT) P444.4(IN)
NetP444_1: P444.1(OUT) P445.4(IN)
NetP445_1: P445.1(OUT) P446.4(IN)
NetP446_1: P446.1(OUT) P447.4(IN)
NetP447_1: P447.1(OUT) P448.4(IN)
NetP448_1: P448.1(OUT) P449.4(IN)
NetP449_1: P449.1(OUT) P450.4(IN)
NetP450_1: P450.1(OUT) P451.4(IN)
NetP451_1: P451.1(OUT) P452.4(IN)
NetP452_1: P452.1(OUT) P453.4(IN)
NetP453_1: P453.1(OUT) P454.4(IN)
NetP454_1: P454.1(OUT) P455.4(IN)
NetP455_1: P455.1(OUT) P456.4(IN)
NetP456_1: P456.1(OUT) P457.4(IN)
NetP457_1: P457.1(OUT) P458.4(IN)
NetP458_1: P458.1(OUT) P459.4(IN)
NetP459_1: P459.1(OUT) P460.4(IN)
NetP460_1: P460.1(OUT) P461.4(IN)
NetP461_1: P461.1(OUT) P462.4(IN)
NetP462_1: P462.1(OUT) P463.4(IN)
NetP463_1: P463.1(OUT) P464.4(IN)
NetP464_1: P464.1(OUT) P465.4(IN)
NetP465_1: P465.1(OUT) P466.4(IN)
NetP466_1: P466.1(OUT) P467.4(IN)
NetP467_1: P467.1(OUT) P468.4(IN)
NetP468_1: P468.1(OUT) P469.4(IN)
NetP469_1: P469.1(OUT) P470.4(IN)
NetP470_1: P470.1(OUT) P471.4(IN)
NetP471_1: P471.1(OUT) P472.4(IN)
NetP472_1: P472.1(OUT) P473.4(IN)
NetP473_1: P473.1(OUT) P474.4(IN)
NetP474_1: P474.1(OUT) P475.4(IN)
NetP475_1: P475.1(OUT) P476.4(IN)
NetP476_1: P476.1(OUT) P477.4(IN)
NetP477_1: P477.1(OUT) P478.4(IN)
NetP478_1: P478.1(OUT) P479.4(IN)
NetP479_1: P479.1(OUT) P480.4(IN)
NetP480_1: P480.1(OUT) P481.4(IN)
NetP481_1: P481.1(OUT) P482.4(IN)
NetP482_1: P482.1(OUT) P483.4(IN)
NetP483_1: P483.1(OUT) P484.4(IN)
NetP484_1: P484.1(OUT) P485.4(IN)
NetP485_1: P485.1(OUT) P486.4(IN)
NetP486_1: P486.1(OUT) P487.4(IN)
NetP487_1: P487.1(OUT) P488.4(IN)
NetP488_1: P488.1(OUT) P489.4(IN)
NetP489_1: P489.1(OUT) P490.4(IN)
NetP490_1: P490.1(OUT) P491.4(IN)
NetP491_1: P491.1(OUT) P492.4(IN)
NetP492_1: P492.1(OUT) P493.4(IN)
NetP493_1: P493.1(OUT) P494.4(IN)
NetP494_1: P494.1(OUT) P495.4(IN)
NetP495_1: P495.1(OUT) P496.4(IN)
NetP496_1: P496.1(OUT) P497.4(IN)
NetP497_1: P497.1(OUT) P498.4(IN)
NetP498_1: P498.1(OUT) P499.4(IN)
NetP499_1: P499.1(OUT) P500.4(IN)
NetP500_1: P500.1(OUT) P501.4(IN)
NetP501_1: P501.1(OUT) P502.4(IN)
NetP502_1: P502.1(OUT) P503.4(IN)
NetP503_1: P503.1(OUT) P504.4(IN)
NetP504_1: P504.1(OUT) P505.4(IN)
NetP505_1: P505.1(OUT) P506.4(IN)
NetP506_1: P506.1(OUT) P507.4(IN)
NetP507_1: P507.1(OUT) P508.4(IN)
NetP508_1: P508.1(OUT) P509.4(IN)
NetP509_1: P509.1(OUT) P510.4(IN)
NetP510_1: P510.1(OUT) P511.4(IN)
NetP511_1: P511.1(OUT) P512.4(IN)
NetP512_1: P512.1(OUT) P513.4(IN)
NetP513_1: P513.1(OUT) P514.4(IN)
NetP514_1: P514.1(OUT) P515.4(IN)
NetP515_1: P515.1(OUT) P516.4(IN)
NetP516_1: P516.1(OUT) P517.4(IN)
NetP517_1: P517.1(OUT) P518.4(IN)
NetP518_1: P518.1(OUT) P519.4(IN)
NetP519_1: P519.1(OUT) P520.4(IN)
NetP520_1: P520.1(OUT) P521.4(IN)
NetP521_1: P521.1(OUT) P522.4(IN)
NetP522_1: P522.1(OUT) P523.4(IN)
NetP523_1: P523.1(OUT) P524.4(IN)
NetP524_1: P524.1(OUT) P525.4(IN)
NetP525_1: P525.1(OUT) P526.4(IN)
NetP526_1: P526.1(OUT) P527.4(IN)
NetP527_1: P527.1(OUT) P528.4(IN)
NetP528_1: P528.1(OUT) P529.4(IN)
NetP529_1: P529.1(OUT) P530.4(IN)
NetP530_1: P530.1(OUT) P531.4(IN)
NetP531_1: P531.1(OUT) P532.4(IN)
NetP532_1: P532.1(OUT) P533.4(IN)
NetP533_1: P533.1(OUT) P534.4(IN)
NetP534_1: P534.1(OUT) P535.4(IN)
NetP535_1: P535.1(OUT) P536.4(IN)
NetP536_1: P536.1(OUT) P537.4(IN)
NetP537_1: P537.1(OUT) P538.4(IN)
NetP538_1: P538.1(OUT) P539.4(IN)
NetP539_1: P539.1(OUT) P540.4(IN)
NetP540_1: P540.1(OUT) P541.4(IN)
NetP541_1: P541.1(OUT) P542.4(IN)
NetP542_1: P542.1(OUT) P543.4(IN)
NetP543_1: P543.1(OUT) P544.4(IN)
NetP544_1: P544.1(OUT) P545.4(IN)
NetP545_1: P545.1(OUT) P546.4(IN)
NetP546_1: P546.1(OUT) P547.4(IN)
NetP547_1: P547.1(OUT) P548.4(IN)

Not connected (* = marked no-connect by the designer): P280 1(OUT); P548 1(OUT)

### Notes on the sheet
- Title
- Author:
- Subtitle
- Date:
- Rev:
- File:
- Sheet
- of

### Library data of the parts
C17-C58 = E6 - 4.7uF: SMD Ceramic Capacitor E6; Component Value: 1µF 25V; Component Description: Multilayer Ceramic Capacitors MLCC; ComponentLink1Description: Datasheet; ComponentLink1URL: https://wmsc.lcsc.com/wmsc/upload/file/pdf/v2/lcsc/2304140030_Samsung-Electro-Mechanics-CL05A105KA5NQNC_C52923.pdf; Digikey: 445-9066-1-ND; Farnell: 2346884; JLC-Parts: C52923; Mouser: 810-C1005X5R1E105K; Unit Price: 0.01
P1-P548 = P-XL-1010RGBC-WS2812B: Smart RGB-LED; JLC-Parts: C5349953; ComponentLink1Description: Datasheet; ComponentLink1URL: https://wmsc.lcsc.com/wmsc/upload/file/pdf/v2/lcsc/2402181502_XINGLIGHT-XL-1010RGBC-WS2812B_C5349953.pdf; Component Description: Smart RGB-LED; Component Value: XL-1010RGBC-WS2812B; Unit Price: 0.05

## Nets that join several sheets
5V: Liv_Flo_Sign_MCU_V1.0 (6 pins), Liv_Flo_Sign_LED_V1.0 (590 pins)
GND: Liv_Flo_Sign_MCU_V1.0 (31 pins), Liv_Flo_Sign_LED_V1.0 (590 pins)
LED_MAT: Liv_Flo_Sign_MCU_V1.0 (K1.D R5.2), Liv_Flo_Sign_LED_V1.0 (P1.4)
LED_SIGN: Liv_Flo_Sign_MCU_V1.0 (K2.D R7.2), Liv_Flo_Sign_LED_V1.0 (P281.4)